# EAGLE design exam elec (EAGLE 8.3.1)
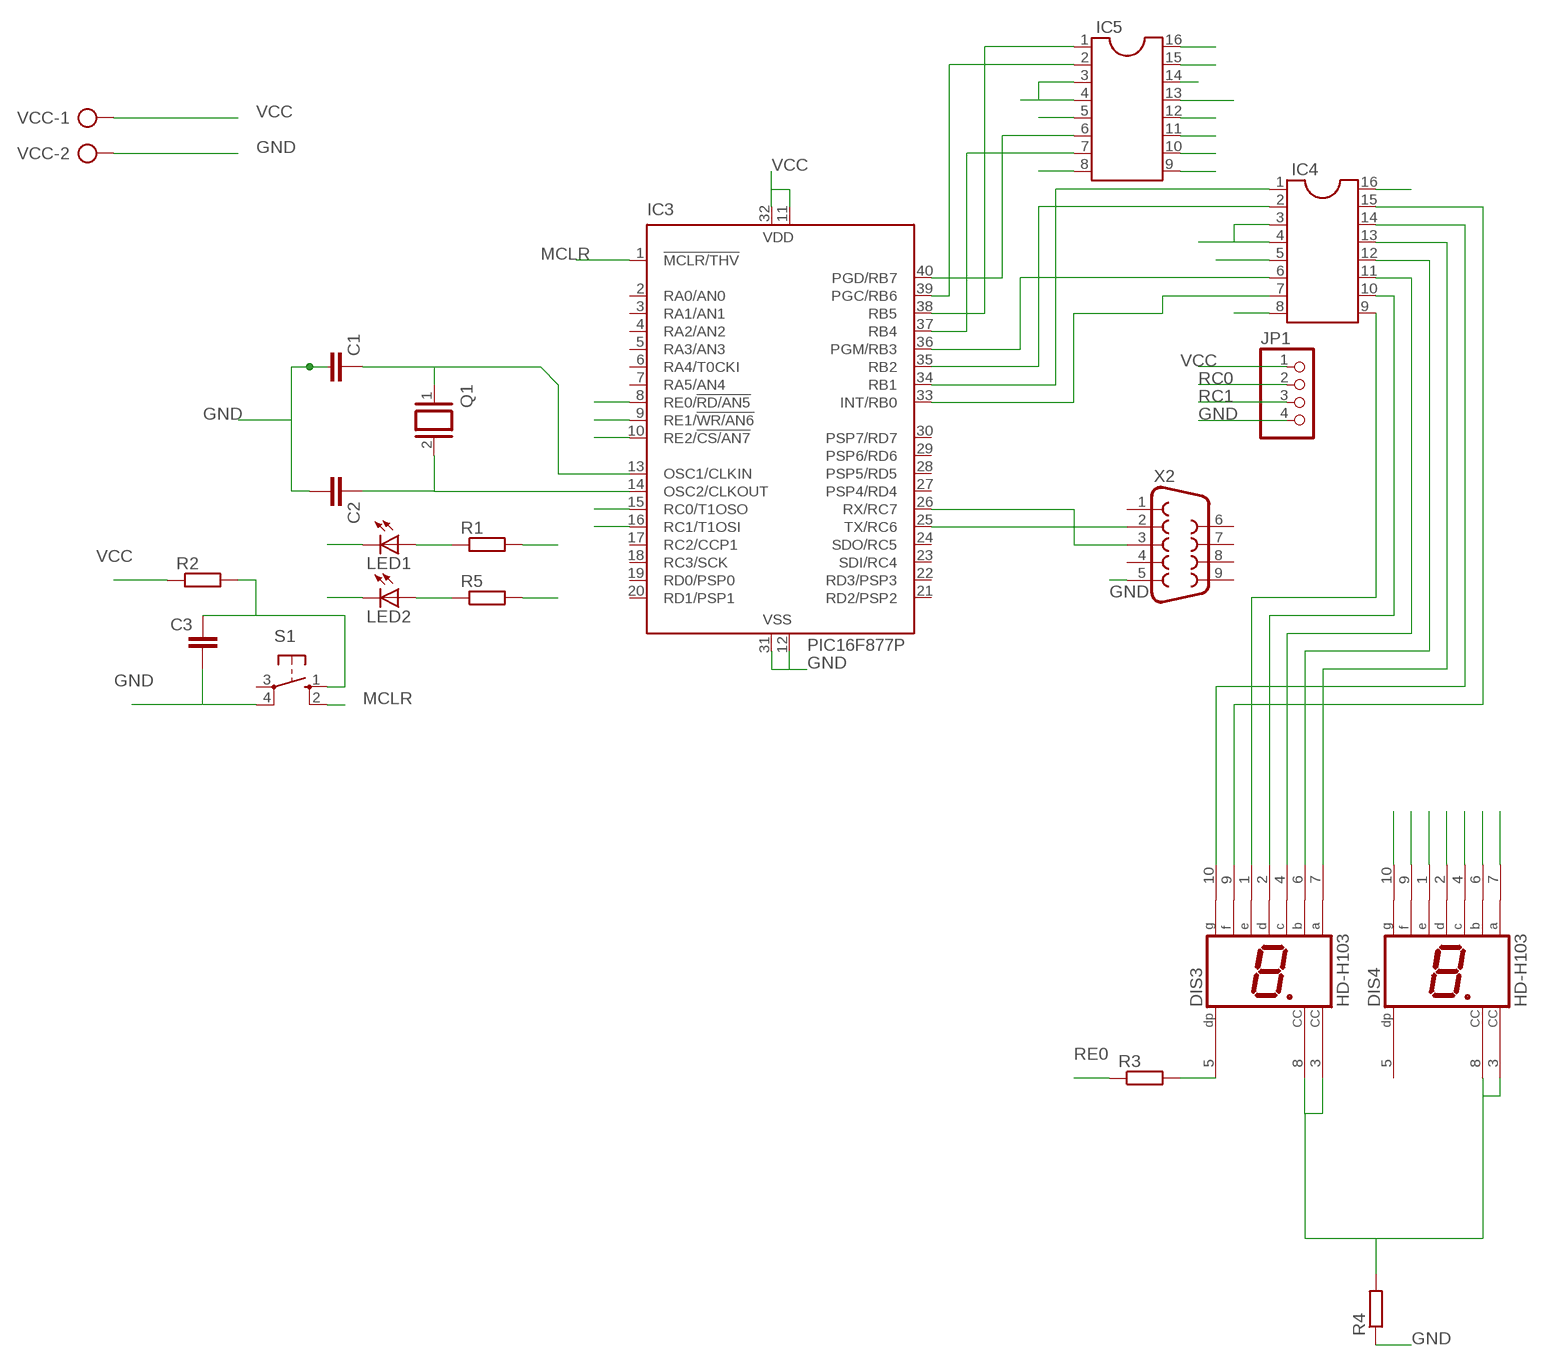
[diagram p0: schematic, sheet 1]

## Parts
C1  C-EU025-025X050  [C025-025X050]
C2  C-EU025-025X050  [C025-025X050]
C3  C-EU025-025X050  [C025-025X050]
DIS3  HD-H103  [HDSP-M]
DIS4  HD-H103  [HDSP-M]
IC3  PIC16F877P  [DIL40]
IC4  DIL16  [DIL16]
IC5  DIL16  [DIL16]
JP1  PINHD-1X4  [1X04]
LED1  LED5MM  [LED5MM]
LED2  LED5MM  [LED5MM]
Q1  XTAL/S  [QS]
R1  R-EU_0204/7  [0204/7]
R2  R-EU_0204/7  [0204/7]
R3  R-EU_0204/7  [0204/7]
R4  R-EU_0204/7  [0204/7]
R5  R-EU_0204/7  [0204/7]
S1  10-XX  [B3F-10XX]
VCC  AK300/2  [AK300/2]
X2  F09H  [F09H]

## Nets
A: DIS4.7(A) IC5.13
B: DIS4.6(B) IC5.12
C: DIS4.4(C) IC5.11
D: DIS4.2(D) IC5.10
E: DIS4.1(E) IC5.9
F: DIS4.9(F) IC5.15
G: DIS4.10(G) IC5.14
GND: C1.2 C2.2 C3.2 IC3.12(VSS) IC3.31(VSS) IC4.5 IC4.8 IC5.5 IC5.8 JP1.4 LED1.K(C) LED2.K(C) R4.1 S1.4(P1) VCC.2 X2.5
MCLR: IC3.1(!MCLR/THV) S1.2(S1)
N$1: IC3.33(INT/RB0) IC4.7
N$2: C1.1 IC3.13(OSC1/CLKIN) Q1.1
N$3: C2.1 IC3.14(OSC2/CLKOUT) Q1.2
N$4: IC3.34(RB1) IC4.1
N$5: IC3.35(RB2) IC4.2
N$6: IC3.25(TX/RC6) X2.2
N$7: IC3.26(RX/RC7) X2.3
N$8: IC3.36(PGM/RB3) IC4.6
N$9: IC3.37(RB4) IC5.7
N$10: IC3.38(RB5) IC5.1
N$11: IC3.39(PGC/RB6) IC5.2
N$12: IC3.40(PGD/RB7) IC5.6
N$13: DIS3.1(E) IC4.9
N$14: DIS3.2(D) IC4.10
N$15: DIS3.4(C) IC4.11
N$16: DIS3.6(B) IC4.12
N$17: DIS3.7(A) IC4.13
N$18: DIS3.10(G) IC4.14
N$19: DIS3.9(F) IC4.15
N$21: DIS3.3(CC) DIS3.8(CC) DIS4.3(CC) DIS4.8(CC) R4.2
N$22: DIS3.5(DP) R3.2
N$26: C3.1 R2.2 S1.1(S)
N$27: LED2.A R5.1
N$28: LED1.A R1.1
RC0: IC3.15(RC0/T1OSO) JP1.2
RC1: IC3.16(RC1/T1OSI) JP1.3
RE0: IC3.8(RE0/!RD/AN5) R3.1
RE1: IC3.9(RE1/!WR/AN6) R1.2
RE2: IC3.10(RE2/!CS/AN7) R5.2
VCC: IC3.11(VDD) IC3.32(VDD) IC4.3 IC4.4 IC4.16 IC5.3 IC5.4 IC5.16 JP1.1 R2.1 VCC.1
Unconnected: DIS4.5(DP) IC3.2(RA0/AN0) IC3.3(RA1/AN1) IC3.4(RA2/AN2) IC3.5(RA3/AN3) IC3.6(RA4/T0CKI) IC3.7(RA5/AN4) IC3.17(RC2/CCP1) IC3.18(RC3/SCK) IC3.19(RD0/PSP0) IC3.20(RD1/PSP1) IC3.21(RD2/PSP2) IC3.22(RD3/PSP3) IC3.23(SDI/RC4) IC3.24(SDO/RC5) IC3.27(PSP4/RD4) IC3.28(PSP5/RD5) IC3.29(PSP6/RD6) IC3.30(PSP7/RD7) S1.3(P) X2.1 X2.4 X2.6 X2.7 X2.8 X2.9

## Library data of the parts
C1-C3 = rcl:C-EU: CAPACITOR, European symbol
DIS3 DIS4 = display-hp:HD-H103: LED DISPLAY 1-character 7 segment, decimal point right; OC_FARNELL: unknown; OC_NEWARK: unknown
IC3 = microchip:PIC16F87*: MICROCONTROLLER; MF: MICROCHIP; MPN: PIC16F877-04/P; OC_FARNELL: 9761349; OC_NEWARK: 61K3463
IC4 IC5 = ic-package:DIL16: Dual In Line / Socket
JP1 = pinhead:PINHD-1X4: PIN HEADER
LED1 LED2 = led:LED: LED OSRAM: - CHIPLED LG R971, LG N971, LY N971, LG Q971, LY Q971, LO R971, LY R971 LH N974, LH R974 LS Q976, LO Q976, LY Q976 LO Q996 - Hyper CHIPLED LW Q18S LB Q993, LB Q99A, LB R99A - SideLED LS A670, LO A670, LY A670, LG A670, LP A670 LB A673, LV A673, LT A673, LW A673 LH A674 LY A675 LS A676, LA A676, LO A676, LY A676, LW A676 LS A679, LY A679, LG A679 - Hyper Micro SIDELED® LS Y876, LA Y876, LO Y876, LY Y876 LT Y87S - SmartLED LW L88C, LW L88S LB L89C, LB L89S, LG L890 LS L89K, LO L89K, LY L89K LS L896, LA L896, LO L896, LY L896 - TOPLED LS T670, LO T670, LY T670, LG T670, LP T670 LSG T670, LSP T670, LSY T670, LOP T670, LYG T670 LG T671, LOG T671, LSG T671 LB T673, LV T673, LT T673, LW T673 LH T674 LS T676, LA T676, LO T676, LY T676, LB T676, LH T676, LSB T676, LW T676 LB T67C, LV T67C, LT T67C, LS T67K, LO T67K, LY T67K, LW E67C LS E67B, LA E67B, LO E67B, LY E67B, LB E67C, LV E67C, LT E67C LW T67C LS T679, LY T679, LG T679 LS T770, LO T770, LY T770, LG T770, LP T770 LB T773, LV T773, LT T773, LW T773 LH T774 LS E675, LA E675, LY E675, LS T675 LS T776, LA T776, LO T776, LY T776, LB T776 LHGB T686 LT T68C, LB T68C - Hyper Mini TOPLED® LB M676 - Mini TOPLED Santana® LG M470 LS M47K, LO M47K, LY M47K Source: http://www.osram.convergy.de LUXEON: - LUMILED® LXK2-PW12-R00, LXK2-PW12-S00, LXK2-PW14-U00, LXK2-PW14-V00 LXK2-PM12-R00, LXK2-PM12-S00, LXK2-PM14-U00 LXK2-PE12-Q00, LXK2-PE12-R00, LXK2-PE12-S00, LXK2-PE14-T00, LXK2-PE14-U00 LXK2-PB12-K00, LXK2-PB12-L00, LXK2-PB12-M00, LXK2-PB14-N00, LXK2-PB14-P00, LXK2-PB14-Q00 LXK2-PR12-L00, LXK2-PR12-M00, LXK2-PR14-Q00, LXK2-PR14-R00 LXK2-PD12-Q00, LXK2-PD12-R00, LXK2-PD12-S00 LXK2-PH12-R00, LXK2-PH12-S00 LXK2-PL12-P00, LXK2-PL12-Q00, LXK2-PL12-R00 Source: www.luxeon.com KINGBRIGHT: KA-3528ASYC Source: www.kingbright.com
Q1 = special:XTAL/S: CRYSTAL
R1-R5 = rcl:R-EU_: RESISTOR, European symbol
S1 = switch-omron:10-XX: OMRON SWITCH; MPN: B3F-1000; OC_FARNELL: 176432; OC_NEWARK: 36M3542
VCC = con-ptr500:AK300/2: CONNECTOR; OC_FARNELL: unknown; OC_NEWARK: unknown
X2 = con-subd:F09: SUB-D; OC_FARNELL: unknown; OC_NEWARK: unknown

## Board
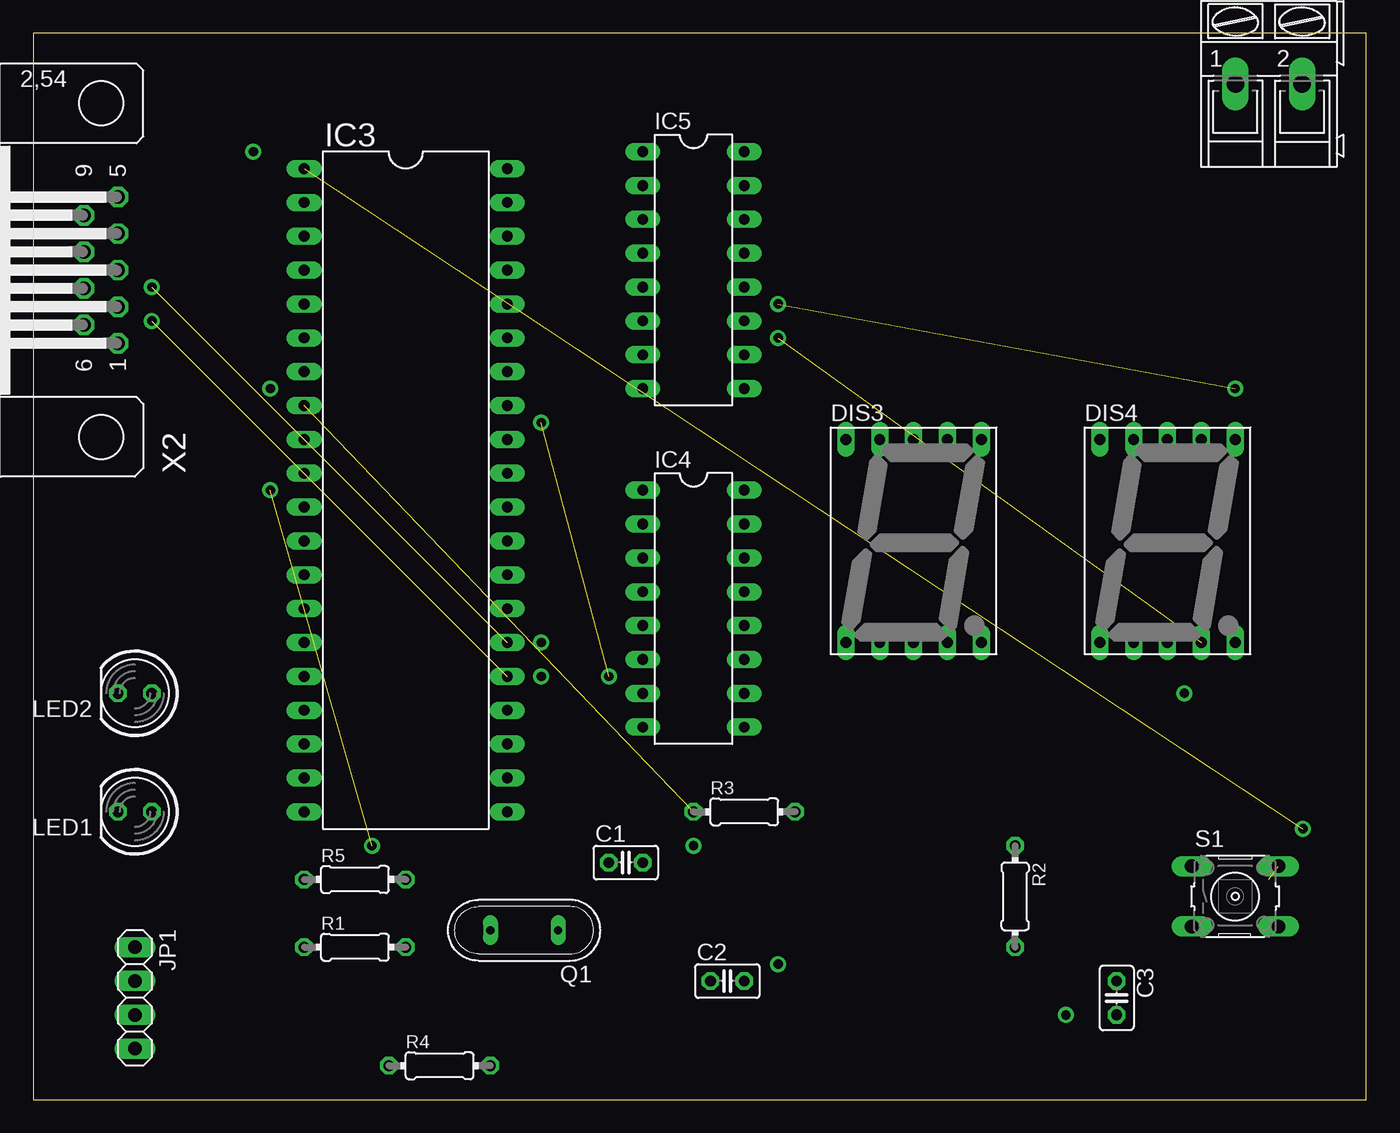
[diagram p1: board, top side]
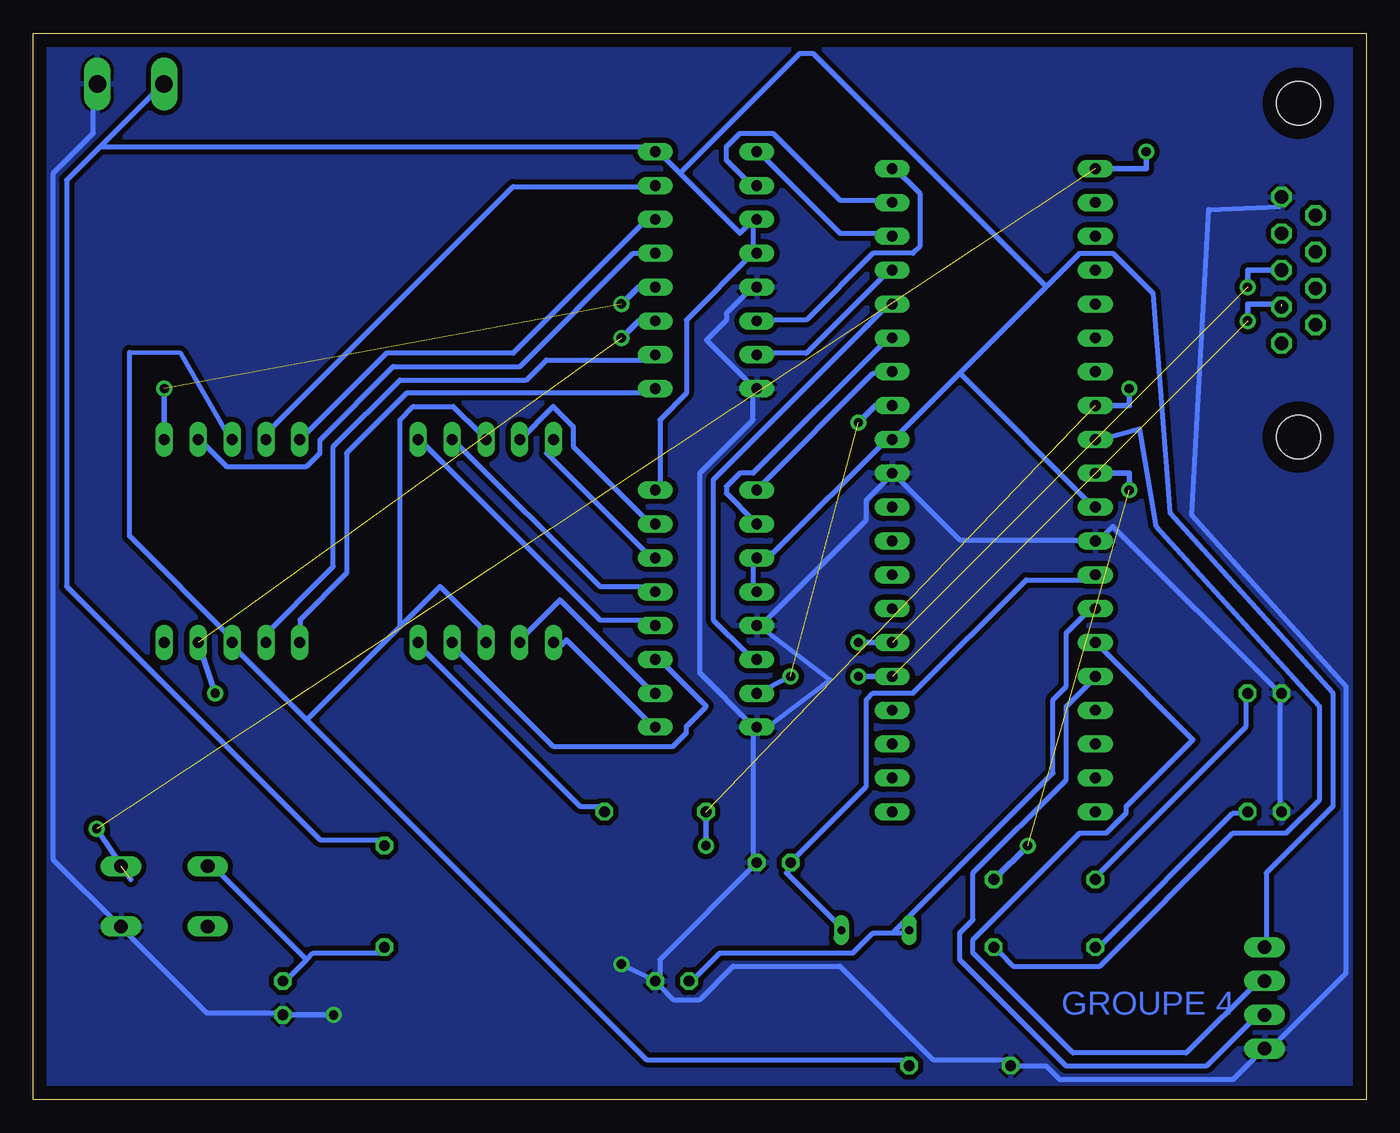
[diagram p2: board, bottom side, seen from below]

Size 100 x 80 mm. Coordinates in mm from the lower left corner, seen from the top.
Outline: 0,0 100,0 100,80 0,80 0,0
Copper layers (1*16): Top 0.035mm / dielectric 1.5mm / Bottom 0.035mm
Design rules "default *": minimum track width 15mil, minimum drill 0.35mm, track to track 15mil, track to pad 15mil, pad to pad 15mil, via to via 15mil, smd to smd 15mil, copper to edge 40mil, drill to drill 6mil, minimum pad ring 10mil, minimum via ring 8mil, stop-mask expansion 4mil, vias tented up to drill 0mil, thermal gap 10mil

### Footprints (pad centres in the part's own frame; a part is rotated, then mirrored left to right if it is on the bottom)
C025-025X050 = drill 0.813 octagon: 1 -1.27,0; 2 1.27,0
HDSP-M = drill 0.813 long: 1 -5.08,-7.62; 2 -2.54,-7.62; 3 0,-7.62; 4 2.54,-7.62; 5 5.08,-7.62; 6 5.08,7.62; 7 2.54,7.62; 8 0,7.62; 9 -2.54,7.62; 10 -5.08,7.62
DIL40 = drill 0.813 long: 1 -24.13,-7.62; 2 -21.59,-7.62; 3 -19.05,-7.62; 4 -16.51,-7.62; 5 -13.97,-7.62; 6 -11.43,-7.62; 7 -8.89,-7.62; 8 -6.35,-7.62; 9 -3.81,-7.62; 10 -1.27,-7.62; 11 1.27,-7.62; 12 3.81,-7.62; 13 6.35,-7.62; 14 8.89,-7.62; 15 11.43,-7.62; 16 13.97,-7.62; 17 16.51,-7.62; 18 19.05,-7.62; 19 21.59,-7.62; 20 24.13,-7.62; 21 24.13,7.62; 22 21.59,7.62; 23 19.05,7.62; 24 16.51,7.62; 25 13.97,7.62; 26 11.43,7.62; 27 8.89,7.62; 28 6.35,7.62; 29 3.81,7.62; 30 1.27,7.62; 31 -1.27,7.62; 32 -3.81,7.62; 33 -6.35,7.62; 34 -8.89,7.62; 35 -11.43,7.62; 36 -13.97,7.62; 37 -16.51,7.62; 38 -19.05,7.62; 39 -21.59,7.62; 40 -24.13,7.62
DIL16 = drill 0.813 long: 1 -8.89,-3.81; 2 -6.35,-3.81; 3 -3.81,-3.81; 4 -1.27,-3.81; 5 1.27,-3.81; 6 3.81,-3.81; 7 6.35,-3.81; 8 8.89,-3.81; 9 8.89,3.81; 10 6.35,3.81; 11 3.81,3.81; 12 1.27,3.81; 13 -1.27,3.81; 14 -3.81,3.81; 15 -6.35,3.81; 16 -8.89,3.81
1X04 = drill 1.016 long: 1 -3.81,0; 2 -1.27,0; 3 1.27,0; 4 3.81,0
LED5MM = drill 0.813 octagon: A -1.27,0; K 1.27,0
QS = drill 0.61 long: 1 -2.54,0; 2 2.54,0
0204/7 = drill 0.813 octagon: 1 -3.81,0; 2 3.81,0
B3F-10XX = drill 1.016 long: 1 -3.251,2.261; 2 3.251,2.261; 3 -3.251,-2.261; 4 3.251,-2.261
AK300/2 = drill 1.321 long: 1 -2.515,0; 2 2.489,0
F09H = drill 1.016 octagon: 1 -5.486,-1.27; 2 -2.743,-1.27; 3 0,-1.27; 4 2.743,-1.27; 5 5.486,-1.27; 6 -4.115,1.27; 7 -1.372,1.27; 8 1.372,1.27; 9 4.115,1.27 | hole 3.302: -12.522,0; 12.522,0

### Placement (x,y rotation side)
C1  44.45,17.78 0 top
C2  52.07,8.89 0 top
C3  81.28,7.62 270 top
DIS3  66.04,41.91 0 top
DIS4  85.09,41.91 0 top
IC3  27.94,45.72 270 top
IC4  49.53,36.83 270 top
IC5  49.53,62.23 270 top
JP1  7.62,7.62 270 top
LED1  7.62,21.59 180 top
LED2  7.62,30.48 180 top
Q1  36.83,12.7 180 top
R1  24.13,11.43 0 top
R2  73.66,15.24 270 top
R3  53.34,21.59 0 top
R4  30.48,2.54 0 top
R5  24.13,16.51 0 top
S1  90.17,15.24 0 top
VCC  92.71,76.2 0 top
X2  5.08,62.23 90 top

### Tracks (layer width: path | path; a pad name or v marks a point on that pad's centre or on a via)
A
  Bottom 0.381: IC5.13 55,63.5 63.5,55 73,55 78.5,49.5 78.5,48.5 79.5,47.5 85.5,47.5 87.5,49.5 DIS4.7
B  (via drill 0.7 pad 1.2)  (1 unrouted)
  Bottom 0.4: IC5.12 54.61,60.96 v55.88,59.69 | DIS4.6 v90.17,53.34
C  (via drill 0.7 pad 1.2)  (1 unrouted)
  Bottom 0.4: IC5.11 54.61,58.42 v55.88,57.15 | DIS4.4 v86.36,30.48
D
  Bottom 0.381: IC5.10 53.5,55.5 61.5,55.5 63,54 72.5,54 77.5,49 77.5,40 83,34.5 DIS4.2
E
  Bottom 0.381: DIS4.1 80,34.5 80,36 76.5,39.5 76.5,48.5 72,53 53.5,53 IC5.9
F
  Bottom 0.381: IC5.15 53.5,68.5 64,68.5 82.5,50 DIS4.9
G
  Bottom 0.381: DIS4.10 80,50 79.5,50 73.5,56 64,56 53.5,66.5 IC5.14
GND  (via drill 0.7 pad 1.2)
  Bottom 0.381: C3.2 81.5,6.5 87,6.5 93,12.5 S1.4 93.5,13 98.5,18 98.5,69.5 95.5,72.5 95.5,76 VCC.2 | X2.5 6.5,67.5 6.5,67 11.81,66.77 13.08,43.85 1.5,31 1.5,9.5 7.5,3.5 JP1.4 8,3.5 10,1.5 23,1.5 24,2.5 26.5,2.5 R4.1 27,3 32.5,3 39.5,10 47.5,10 50,7.5 52,7.5 53,8.5 C2.2 53,9 53,10.5 C1.2 46,18 46,27.5 IC4.8 | LED1.K 6.5,22 6.5,30 LED2.K 6.5,30.5 19,43 20,42 IC3.12 20.5,42 30.5,42 35.5,47 IC3.31 36,46.5 37.5,45 37.5,43.5 45.5,35.5 | IC5.5 46,61 48,59 48,58.5 49.5,57 46,53.5 IC5.8 46,53 46,51 50,47 50,32 46,28 IC4.8 | 45.5,35.5 40.23,31.5 45.5,27.5 IC4.8 | 45.5,35.5 IC4.5
  Bottom 0.4: C2.2 v55.88,10.16 | C3.2 v77.47,6.35
  pour Bottom: 0,80.01 100.33,80.01 100.33,0 0,0
MCLR  (via drill 0.7 pad 1.2)  (2 unrouted)
  Bottom 0.4: IC3.1 16.51,69.85 v16.51,71.12 | v95.25,20.32 92.71,16.51
N$1  (via drill 0.7 pad 1.2)  (1 unrouted)
  Bottom 0.4: IC3.33 36.83,52.07 v38.1,50.8 | IC4.7 v43.18,31.75
N$2
  Bottom 0.381: Q1.1 39.5,13 43.5,17 43,17.5 C1.1 43,18 37.5,23.5 37.5,30 37,30.5 34,30.5 25.5,39 20.5,39 IC3.13
N$3
  Bottom 0.381: 35.5,12.5 37,12.5 38.5,11 48.5,11 50.5,9 C2.1 | 35.5,12.5 34.5,12.5 Q1.2 | 35.5,12.5 23.5,24.5 23.5,30 22.5,31 22.5,35 21,36.5 20.5,36.5 IC3.14
N$4
  Bottom 0.381: IC3.34 36,54.5 37,54.5 45.5,46 IC4.1
N$5
  Bottom 0.381: IC4.2 46,43.5 48,45.5 48,46 47,47 46,47 36,57 IC3.35
N$6  (via drill 0.7 pad 1.2)  (2 unrouted)
  Bottom 0.4: 6.35,59.69 8.89,59.69 v8.89,58.42 | IC3.25 v38.1,31.75
N$7  (via drill 0.7 pad 1.2)  (1 unrouted)
  Bottom 0.4: X2.3 8.89,62.23 v8.89,60.96 | IC3.26 v38.1,34.29
N$8
  Bottom 0.381: IC4.6 46,33.5 46.5,33.5 49,36 49,46.5 36,59.5 IC3.36
N$9
  Bottom 0.381: IC5.7 45.5,56 42,56 36,62 IC3.37
N$10
  Bottom 0.381: IC3.38 36,65 39.5,65 45.5,71 IC5.1
N$11
  Bottom 0.381: IC3.39 36,67.5 39.5,67.5 44.5,72.5 47,72.5 48,71.5 48,70.5 46,68.5 IC5.2
N$12
  Bottom 0.381: IC5.6 45.5,58.5 42,58.5 37,63.5 34,63.5 33.5,64 33.5,68 35.5,70 IC3.40
N$13
  Bottom 0.381: IC4.9 53.5,28 60,34.5 60.5,34 DIS3.1
N$14
  Bottom 0.381: IC4.10 53.5,30.5 60.5,37.5 63.5,34.5 DIS3.2
N$15
  Bottom 0.381: IC4.11 53,33 49.5,29.5 51,28 51,27.5 52,26.5 61,26.5 68.5,34 DIS3.4
N$16
  Bottom 0.381: IC4.12 53.5,36 57.5,36 71,49.5 DIS3.6
N$17
  Bottom 0.381: IC4.13 53.5,38.5 57.5,38.5 68.5,49.5 DIS3.7
N$18
  Bottom 0.381: IC4.14 53.5,41 54,41 61.5,48.5 60.5,49.5 DIS3.10
N$19
  Bottom 0.381: IC4.15 53.5,43.5 54,43.5 59.5,49 59.5,50.5 61,52 63.5,49.5 DIS3.9
N$21
  Bottom 0.381: 79.5,28.5 85,34 DIS4.3 85,34.5 92.77,42.27 92.77,56.08 89,56.04 85.5,50 DIS4.8 | 79.5,28.5 54,3 34.5,3 R4.2 | 79.5,28.5 72.5,35.5 | 72.5,35.5 69.5,38.5 66.5,35.5 66.5,34.5 DIS3.3 | 72.5,35.5 72.5,51 71.5,52 68.5,52 66.5,50 DIS3.8
N$22
  Bottom 0.381: R3.2 57.5,22 59,22 71,34 DIS3.5
N$26
  Bottom 0.381: 79.5,10.5 81,9 C3.1 | 79.5,10.5 79,11 74,11 R2.2 | 79.5,10.5 86.5,17.5 S1.1
N$27
  Bottom 0.381: LED2.A 9,30 9,28 20,17 R5.1
N$28
  Bottom 0.381: LED1.A 9,21.5 10,21.5 20,11.5 R1.1
RC0
  Bottom 0.381: IC3.15 20,34 13,27 18,22 18,21.5 19.5,20 21.5,20 29.5,12 29.5,11 22,3.5 13.5,3.5 8,9 JP1.2
RC1
  Bottom 0.381: IC3.16 20.5,31.5 22.5,29.5 22.5,24 29.5,17 29.5,13.5 30.5,12.5 30.5,10.5 22.5,2.5 12,2.5 8,6.5 JP1.3
RE0  (via drill 0.7 pad 1.2)  (1 unrouted)
  Bottom 0.4: IC3.8 17.78,52.07 v17.78,53.34 | R3.1 v49.53,19.05
RE1
  Bottom 0.381: IC3.9 20,49.5 17,50.31 15.73,43 3.5,29.5 3.5,22.5 6,20 10,20 20,10 26.5,10 27.5,11 R1.2
RE2  (via drill 0.7 pad 1.2)  (1 unrouted)
  Bottom 0.4: IC3.10 17.78,46.99 v17.78,45.72 | R5.2 v25.4,19.05
VCC
  Bottom 0.381: IC4.4 46,38.5 46,40.5 IC4.3 45.5,41 44.5,41 36,49.5 IC3.32 35.5,49.5 30.5,54.5 | 30.5,54.5 20.5,44.5 IC3.11 | 30.5,54.5 24,61 | 24,61 21.5,63.5 19,63.5 16,60.5 14.73,44 2.5,30.5 2.5,22 7.5,17 7.5,11.5 JP1.1 | 46,66 46,63.5 | 46,63.5 51,58.5 51,53 53,51 53,46 IC4.16 | 46,63.5 IC5.4 | 51.5,69.5 47,65 46,66 | 51.5,69.5 53,71 IC5.16 53.5,71.5 95,71.5 | 46,66 IC5.3 | 95,71.5 90.5,76 VCC.1 | 95,71.5 97.5,69 97.5,38.5 78.5,19.5 74,19.5 R2.1 | 24,61 41.5,78.5 42.5,78.5 51.5,69.5

### Text on the board
Bottom: GROUPE 4